# EAGLE design RS485 Adapter (EAGLE 9.6.0)
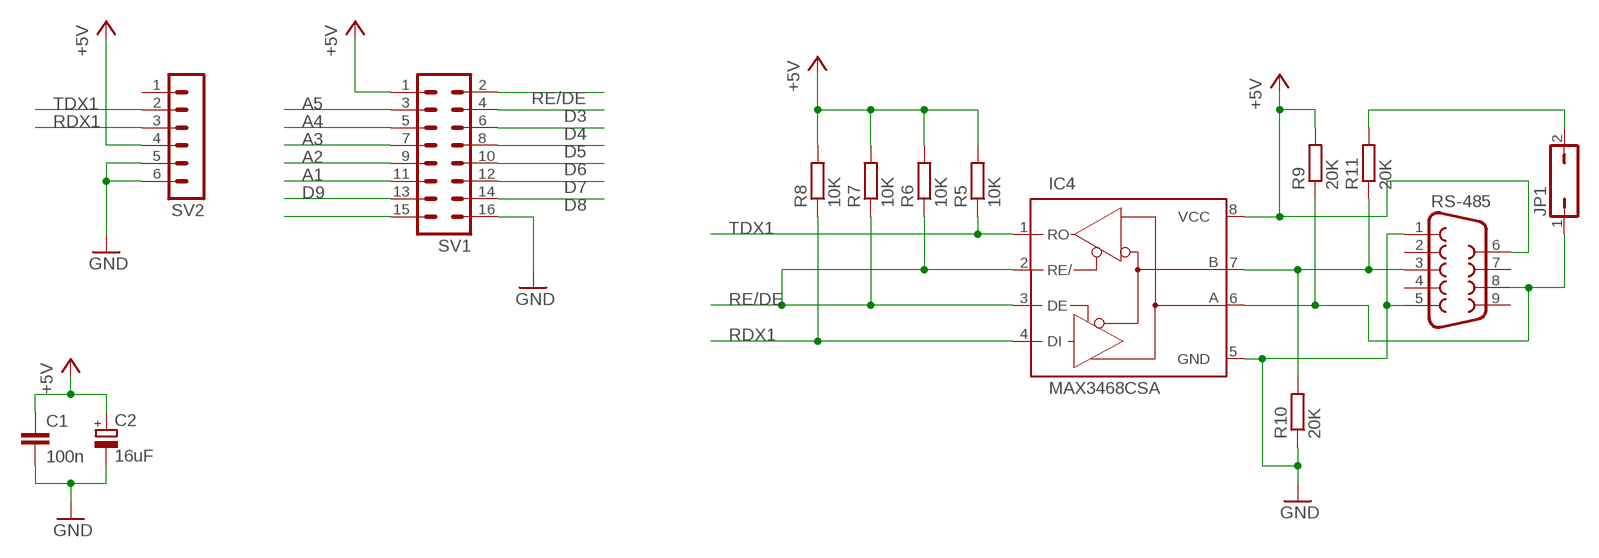
[diagram p0: schematic, sheet 1]

## Parts
C1  100n  C-EUC0402  [C0402]
C2  16uF  CPOL-EUA/3216-18R  [A/3216-18R]
IC4  MAX3468CSA  [SO08]
JP1  JP1Q  [JP1]
R5  10K  R-EU_MELF0102R  [MINI_MELF-0102R]
R6  10K  R-EU_MELF0102R  [MINI_MELF-0102R]
R7  10K  R-EU_MELF0102R  [MINI_MELF-0102R]
R8  10K  R-EU_MELF0102R  [MINI_MELF-0102R]
R9  20K  R-EU_MELF0102R  [MINI_MELF-0102R]
R10  20K  R-EU_MELF0102R  [MINI_MELF-0102R]
R11  20K  R-EU_MELF0102R  [MINI_MELF-0102R]
RS-485  F09V  [F09V]
SV1  MA08-2  [MA08-2]
SV2  MA06-1  [MA06-1]

## Nets
+5V: C1.1 C2.+ IC4.8(VCC) R5.2 R6.2 R7.2 R8.2 R9.2 RS-485.6 SV1.1 SV2.4
A1: SV1.11
A2: SV1.9
A3: SV1.7
A4: SV1.5
A5: SV1.3
D3: SV1.4
D4: SV1.6
D5: SV1.8
D6: SV1.10
D7: SV1.12
D8: SV1.14
D9: SV1.13
GND: C1.2 C2.- IC4.5(GND) R10.1 RS-485.1 RS-485.5 SV1.16 SV2.5 SV2.6
IO14: SV1.15
N$10: IC4.6(A) JP1.1 R9.1 RS-485.8
N$11: IC4.7(B) R10.2 R11.1 RS-485.3
N$12: JP1.2 R11.2
RDX1: IC4.4(DI) R8.1 SV2.3
RE/DE: IC4.2(RE/) IC4.3(DE) R6.1 R7.1 SV1.2
TDX1: IC4.1(RO) R5.1 SV2.2
Unconnected: RS-485.2 RS-485.4 RS-485.7 RS-485.9 SV2.1

## Library data of the parts
C1 = rcl:C-EU: CAPACITOR, European symbol; SPICEPREFIX: C
C2 = rcl:CPOL-EU: POLARIZED CAPACITOR, European symbol; SPICEPREFIX: C
IC4 = maxim:MAX34*: +5V, Fail-Safe, 40Mbps, Profibus RS-485/RS-422 Transceivers Source: MAX3465-MAX3469.pdf; MPN: MAX3468CSA+; OC_FARNELL: unknown; OC_NEWARK: 76K6721
JP1 = jumper:JP1Q: JUMPER
R5-R11 = rcl:R-EU_: RESISTOR, European symbol; SPICEPREFIX: R
RS-485 = con-subd:F09: SUB-D; OC_FARNELL: unknown; OC_NEWARK: unknown
SV1 = con-lstb:MA08-2: PIN HEADER; OC_FARNELL: unknown; OC_NEWARK: unknown
SV2 = con-lstb:MA06-1: PIN HEADER; OC_FARNELL: unknown; OC_NEWARK: unknown

## Board
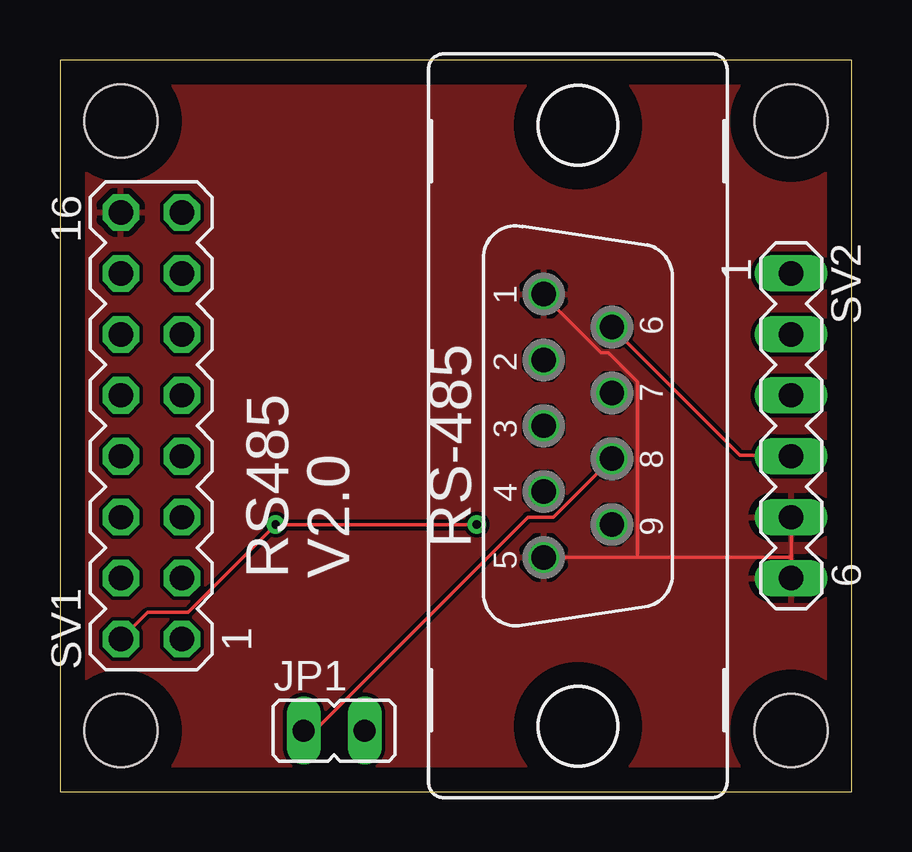
[diagram p1: board, top side]
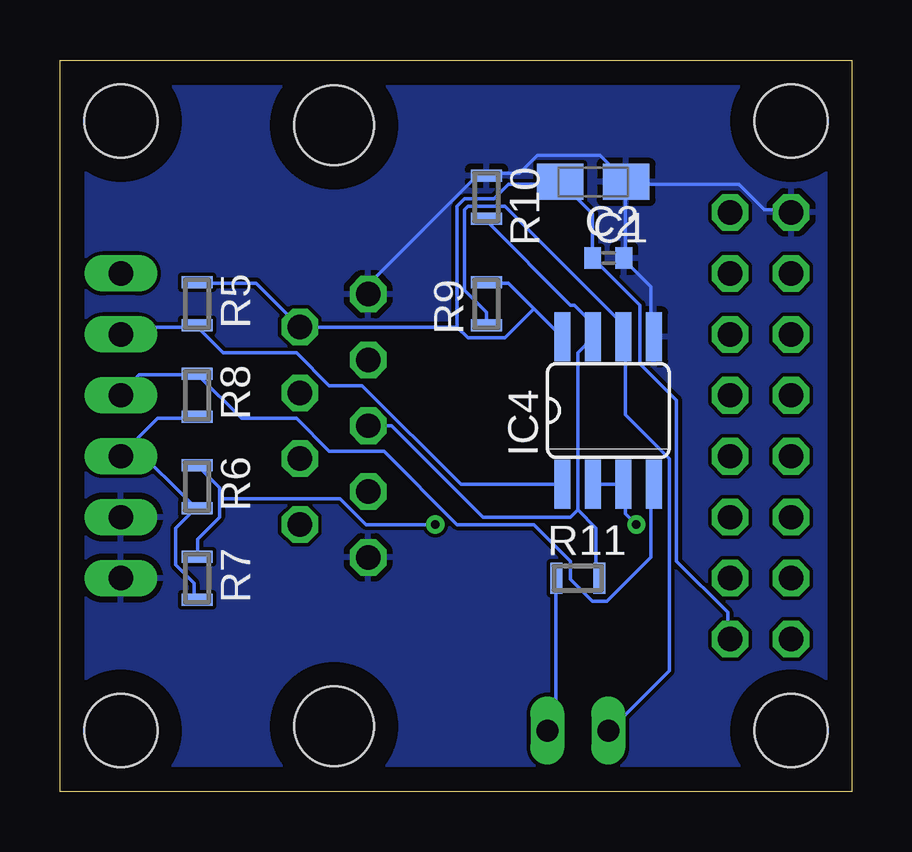
[diagram p2: board, bottom side, seen from below]

Size 33.02 x 30.48 mm. Coordinates in mm from the lower left corner, seen from the top.
Outline: 0,0 33.02,0 33.02,30.48 0,30.48 0,0
Copper layers (1*16): Top 0.035mm / dielectric 1.5mm / Bottom 0.035mm
Design rules "default": minimum track width 6mil, minimum drill 0.35mm, track to track 6mil, track to pad 6mil, pad to pad 6mil, via to via 6mil, smd to smd 6mil, copper to edge 40mil, drill to drill 6mil, minimum pad ring 10mil, minimum via ring 8mil, stop-mask expansion 4mil, vias tented up to drill 0mil, thermal gap 10mil
Holes 3.05 mm at 2.54,2.54 30.48,2.54 2.54,27.94 30.48,27.94

### Footprints (pad centres in the part's own frame; a part is rotated, then mirrored left to right if it is on the bottom)
C0402 = smd 0.7 x 0.9: 1 -0.65,0; 2 0.65,0
A/3216-18R = smd 1.95 x 1.5: + 1.375,0; - -1.375,0
SO08 = smd 0.66 x 2.032: 1 -1.905,-3.073; 2 -0.635,-3.073; 3 0.635,-3.073; 4 1.905,-3.073; 5 1.905,3.073; 6 0.635,3.073; 7 -0.635,3.073; 8 -1.905,3.073
JP1 = drill 0.914 long: 1 0,-1.27; 2 0,1.27
MINI_MELF-0102R = smd 0.5 x 1.3: 1 -0.9,0; 2 0.9,0
F09V = drill 1.016 octagon: 1 5.486,1.422; 2 2.743,1.422; 3 0,1.422; 4 -2.743,1.422; 5 -5.486,1.422; 6 4.115,-1.422; 7 1.372,-1.422; 8 -1.372,-1.422; 9 -4.115,-1.422 | hole 3.302: -12.522,0; 12.522,0
MA08-2 = drill 1.016 octagon: 1 -8.89,-1.27; 2 -8.89,1.27; 3 -6.35,-1.27; 4 -6.35,1.27; 5 -3.81,-1.27; 6 -3.81,1.27; 7 -1.27,-1.27; 8 -1.27,1.27; 9 1.27,-1.27; 10 1.27,1.27; 11 3.81,-1.27; 12 3.81,1.27; 13 6.35,-1.27; 14 6.35,1.27; 15 8.89,-1.27; 16 8.89,1.27
MA06-1 = drill 1.016 long: 1 -6.35,0; 2 -3.81,0; 3 -1.27,0; 4 1.27,0; 5 3.81,0; 6 6.35,0

### Placement (x,y rotation side)
C1  10.16,22.23 0 bottom
C2  10.79,25.4 180 bottom
IC4  10.16,15.88 0 bottom
JP1  11.43,2.54 270 top
R5  27.3,20.32 90 bottom
R6  27.3,12.7 270 bottom
R7  27.3,8.89 270 bottom
R8  27.3,16.51 270 bottom
R9  15.24,20.32 90 bottom
R10  15.24,24.77 270 bottom
R11  11.43,8.89 180 bottom
RS-485  21.59,15.24 90 top
SV1  3.81,15.24 90 top
SV2  30.48,15.24 270 top

### Tracks (layer width: path | path; a pad name or v marks a point on that pad's centre or on a via)
+5V
  Top 0.152: RS-485.6 28.35,14.02 30.48,14.02 SV2.4
  Bottom 0.152: R7.2 27.43,8.08 27.43,8.69 28.19,9.45 28.19,10.97 27.43,11.73 R6.2 27.43,11.89 30.02,14.48 | 30.02,14.48 30.48,14.02 SV2.4 30.02,14.48 | 30.02,14.48 28.96,15.54 27.43,15.54 R8.2 | R5.2 27.28,21.18 24.84,21.18 RS-485.6 16.46,19.36 | 13.26,20.12 12.19,19.05 IC4.8 | 13.26,20.12 14.33,21.18 15.24,21.18 R9.2 | 16.46,19.36 16.46,24.38 16.15,24.69 14.94,24.69 14.33,25.3 12.19,25.3 C2.+ 12.04,25.3 10.82,24.08 10.82,22.25 C1.1 10.67,22.1 8.84,20.27 8.84,17.83 7.32,16.31 7.32,9.6 5.18,7.47 5.18,6.4 SV1.1 | 16.46,19.36 16,18.9 14.48,18.9 13.26,20.12
GND
  Top 0.152: SV2.5 30.48,9.75 | 30.48,9.75 SV2.6 | 30.48,9.75 24.08,9.75 | 24.08,9.75 RS-485.5 | 24.08,9.75 24.08,17.07 22.86,18.29 22.55,18.29 20.12,20.73 RS-485.1
  Bottom 0.152: C2.- 9.45,25.3 9.45,22.25 C1.2 9.45,22.1 8.38,21.03 8.38,19.05 IC4.5 | C2.- 9.45,25.45 10.52,26.52 13.11,26.52 13.87,25.76 15.24,25.76 R10.1 15.24,25.6 15.7,25.6 20.12,21.18 20.12,20.73 RS-485.1 | SV1.16 2.59,24.23 3.66,24.23 4.72,25.3 9.3,25.3 C2.-
  pour Top: 0,30.48 33.02,30.48 33.02,0 0,0
  pour Bottom: 0,30.48 33.02,30.48 33.02,0 0,0
N$10
  Top 0.152: RS-485.8 20.57,11.43 19.51,11.43 10.67,2.59 10.21,2.59 JP1.1
  Bottom 0.152: R9.1 15.24,19.96 16.15,20.88 16.15,24.23 16,24.38 14.48,24.38 9.6,19.51 9.6,19.05 IC4.6 9.45,18.9 9.45,15.7 7.62,13.87 7.62,5.03 10.06,2.59 JP1.1
N$11
  Bottom 0.152: 11.43,11.73 10.67,10.97 10.67,8.99 R11.1 | 11.43,11.73 11.43,18.29 10.82,18.9 IC4.7 10.82,19.05 10.82,19.51 11.58,20.27 11.73,20.27 15.24,23.77 R10.2 | RS-485.3 19.2,15.24 15.39,11.43 11.73,11.43 11.43,11.73
N$12
  Bottom 0.152: JP1.2 12.34,2.9 12.34,8.84 R11.2
RDX1
  Bottom 0.152: SV2.3 30.48,16.61 29.72,17.37 27.43,17.37 R8.1 27.28,17.37 25.45,15.54 23.16,15.54 21.79,14.17 19.51,14.17 16.46,11.12 13.26,11.12 11.73,9.6 11.73,8.84 10.82,7.92 10.21,7.92 8.38,9.75 8.38,12.8 IC4.4
RE/DE  (via drill 0.35)
  Top 0.152: SV1.2 3.66,7.47 5.33,7.47 v8.99,11.12 v17.37,11.12
  Bottom 0.152: 26.36,12.19 26.36,12.65 27.28,13.56 R6.1 | 26.36,12.19 26.36,11.43 27.28,10.52 27.28,9.91 R7.1 | IC4.2 IC4.3 9.45,12.8 9.45,11.58 v8.99,11.12 | 26.36,12.19 21.34,12.19 20.27,11.12 v17.37,11.12
TDX1
  Bottom 0.152: SV2.2 30.18,19.36 27.43,19.36 R5.1 27.28,19.36 26.21,18.29 23.16,18.29 21.79,16.92 20.42,16.92 16.31,12.8 IC4.1

### Text on the board
tNames: RS485 | V2.0